# EAGLE design controller_board (EAGLE 7.2.0)
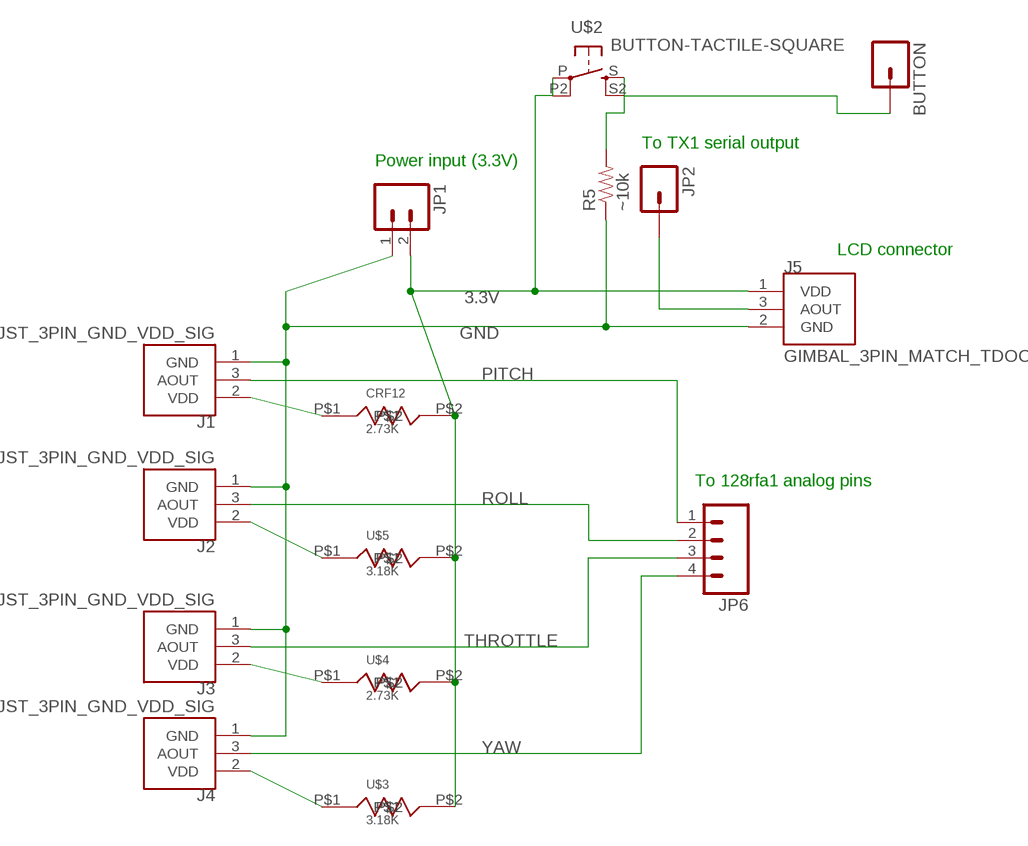
[diagram p0: schematic, sheet 1]

## Parts
BUTTON  M01PTH  [1X01]
CRF12  2.73K  CRF12  [CFR12]
J1  JST_3PIN_GND_VDD_SIG  [JST-3-PTH-REVERSE]
J2  JST_3PIN_GND_VDD_SIG  [JST-3-PTH-REVERSE]
J3  JST_3PIN_GND_VDD_SIG  [JST-3-PTH-REVERSE]
J4  JST_3PIN_GND_VDD_SIG  [JST-3-PTH-REVERSE]
J5  GIMBAL_3PIN_MATCH_TDOCU  [JST-3-PTH]
JP1  M021X02_NO_SILK  [1X02_NO_SILK]
JP2  M01PTH  [1X01]
JP6  M04PTH  [1X04]
R5  ~10k  RESISTORPTH-1/4W  [AXIAL-0.4]
U$2  BUTTON-TACTILE-SQUARE  [BUTTON-TACTILE-SQUARE-ADAFRUIT1010]
U$3  3.18K  CRF12  [CFR12]
U$4  2.73K  CRF12  [CFR12]
U$5  3.18K  CRF12  [CFR12]

## Nets
3.3V: CRF12.P$2 J5.1(VDD) JP1.2 U$2.P U$2.P2(P1) U$3.P$2 U$4.P$2 U$5.P$2
GND: J1.1(GND) J2.1(GND) J3.1(GND) J4.1(GND) J5.2(GND) JP1.1 R5.P$1
N$1: J4.2(VDD) U$3.P$1
N$2: J3.2(VDD) U$4.P$1
N$3: CRF12.P$1 J1.2(VDD)
N$4: J2.2(VDD) U$5.P$1
N$6: BUTTON.1 R5.P$2 U$2.S U$2.S2(S1)
N$9: J5.3(AOUT) JP2.1
PITCH: J1.3(AOUT) JP6.1
ROLL: J2.3(AOUT) JP6.2
THROTTLE: J3.3(AOUT) JP6.3
YAW: J4.3(AOUT) JP6.4

## Notes on the sheet
- To TX1 serial output
- Power input (3.3V)
- LCD connector
- To 128rfa1 analog pins

## Library data of the parts
BUTTON JP2 = SparkFun-Connectors:M01: Header 1 Standard 1-pin 0.1" header. Use with straight break away headers (SKU : PRT-00116), right angle break away headers (PRT-00553), swiss pins (PRT-00743), machine pins (PRT-00117), and female headers (PRT-00115).
CRF12 U$3-U$5 = lab4:CRF12
J1-J4 = Controller:JST_3PIN_GND_VDD_SIG
J5 = Controller:GIMBAL_3PIN_MATCH_TDOCU
JP1 = SparkFun-Connectors:M02: Standard 2-pin 0.1" header. Use with - straight break away headers ( PRT-00116) - right angle break away headers (PRT-00553) - swiss pins (PRT-00743) - machine pins (PRT-00117) - female headers (PRT-00115) Molex polarized connector foot print use with: PRT-08233 with associated crimp pins and housings. 2.54_SCREWTERM for use with PRT-10571. 3.5mm Screw Terminal footprints for PRT-08084 5mm Screw Terminal footprints for use with PRT-08432
JP6 = SparkFun-Connectors:M04: Header 4 Standard 4-pin 0.1" header. Use with straight break away headers (SKU : PRT-00116), right angle break away headers (PRT-00553), swiss pins (PRT-00743), machine pins (PRT-00117), and female headers (PRT-00115). Molex polarized connector foot print use with SKU : PRT-08231 with associated crimp pins and housings. 1MM SMD Version SKU: PRT-10208
R5 = SparkFun-Resistors:RESISTOR: Resistor Basic schematic elements and footprints for 0603, 1206, and PTH resistors.
U$2 = Controller:BUTTON-TACTILE

## Board
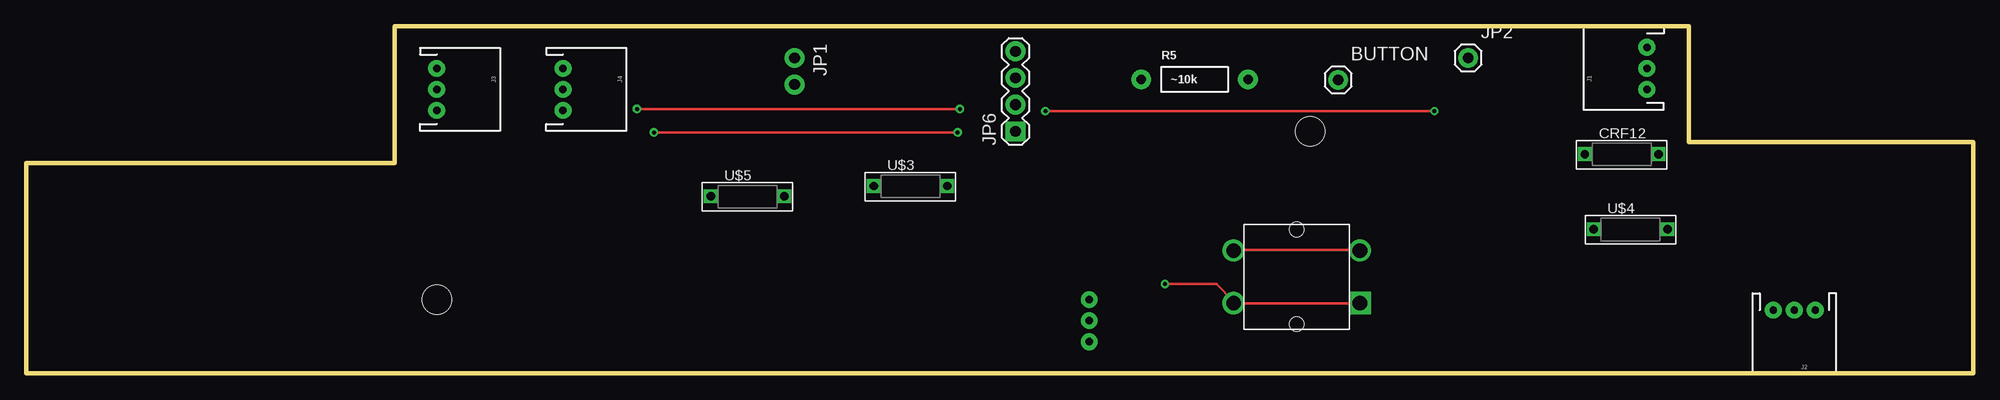
[diagram p1: board, top side]
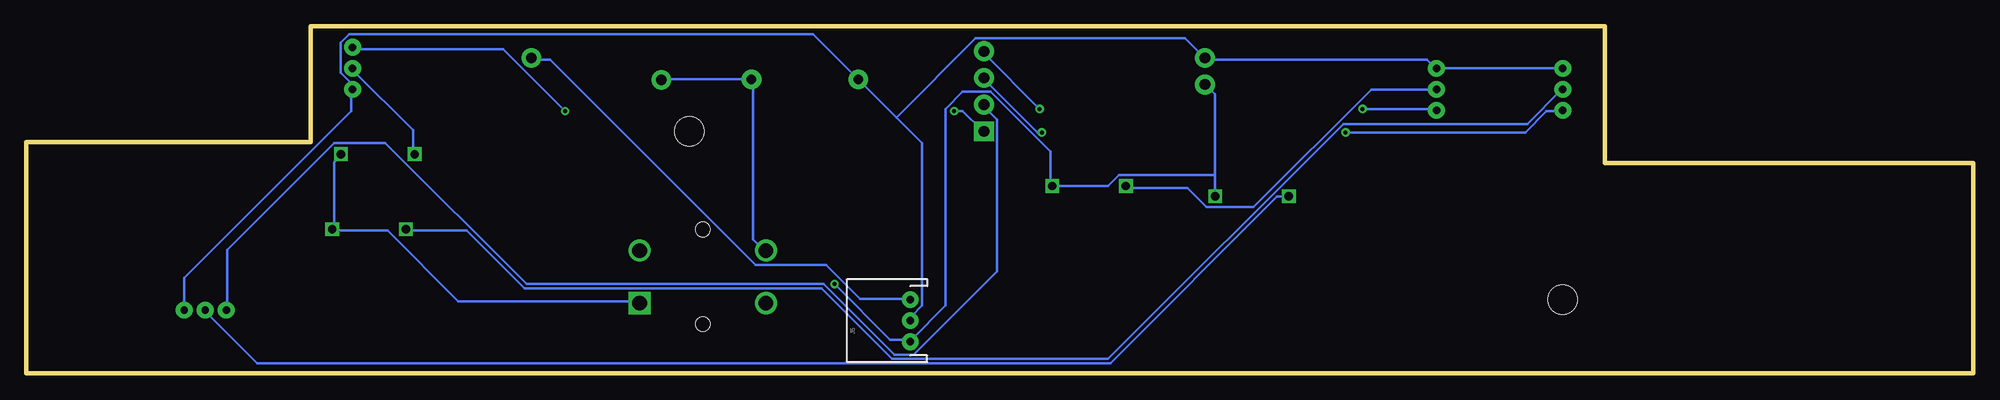
[diagram p2: board, bottom side, seen from below]

Size 185 x 33 mm. Coordinates in mm from the lower left corner, seen from the top.
Outline: 158,22 158,33 35,33 35,20 0,20 0,0 185,0 185,22 158,22
Copper layers (1*16): Top 0.035559375mm / dielectric 1.501140625mm / Bottom 0.035559375mm
Design rules "4pcb-33board": minimum track width 10mil, minimum drill 15mil, track to track 6mil, track to pad 6mil, pad to pad 6mil, via to via 6mil, smd to smd 6mil, copper to edge 10mil, drill to drill 10mil, minimum pad ring 10mil, minimum via ring 8mil, stop-mask expansion 4mil, vias tented up to drill 0mil, thermal gap 10mil
tRestrict: area 36.6,22.5 to 45.5,31.3; area 49.3,22.5 to 56.9,31.3; area 70.9,26.3 to 74.7,31.3; area 63.2,14.8 to 73.4,18.6; area 78.5,16.1 to 88.7,19.9; area 91.2,21.2 to 96.3,32.6; area 103.9,26.3 to 117.9,30.1; area 98.8,0.9 to 107.7,9.8; area 121.7,26.3 to 139.4,31.3; area 147.1,18.6 to 156,22.5; area 147.1,12.3 to 157.2,16.1; area 147.1,25 to 156,32.6; 1 more areas

### Footprints (pad centres in the part's own frame; a part is rotated, then mirrored left to right if it is on the bottom)
1X01 = drill 1.016 pad 1.88: 1 0,0
CFR12 = drill 0.8 square: P$1 -3.5,0; P$2 3.5,0
JST-3-PTH-REVERSE = drill 0.7 pad 1.6: 1 -2,0; 2 0,0; 3 2,0
JST-3-PTH = drill 0.7 pad 1.6: 1 -2,0; 2 0,0; 3 2,0
1X02_NO_SILK = drill 1.016 pad 1.88: 1 0,0; 2 2.54,0
1X04 = drill 1.016 pad 1.88 square: 1 0,0 | drill 1.016 pad 1.88: 2 2.54,0; 3 5.08,0; 4 7.62,0
AXIAL-0.4 = drill 0.9 pad 1.88: P$1 -5.08,0; P$2 5.08,0
CONNECTOR_BOARD_OUTLINE = hole 2.8: 154,45; 71,29
BUTTON-TACTILE-SQUARE-ADAFRUIT1010 = drill 1.4 square: P -6,2.5 | drill 1.4: P2 6,2.5; S -6,-2.5; S2 6,-2.5 | hole 1.4: 0,-4.5; 0,4.5

### Placement (x,y rotation side)
BUTTON  124.66,27.9 0 top
CRF12  151.6,20.83 0 top
J1  154,29 90 top
J2  168,6 180 top
J3  39,27 270 top
J4  51,27 270 top
J5  101,5 90 bottom
JP1  73,30 270 top
JP2  137,30 0 top
JP6  94,23 90 top
R5  111.01,27.94 0 top
U$1  [CONNECTOR_BOARD_OUTLINE]  -32,-22 0 top
U$2  120.72,9.17 180 top
U$3  84.01,17.8 0 top
U$4  152.44,13.7 0 top
U$5  68.53,16.82 0 top

### Tracks (layer width: path | path; a pad name or v marks a point on that pad's centre or on a via)
3.3V  (via drill 0.38)
  Top 0.254: U$2.P 126.7,6.65 114.91,6.65 U$2.P2 114.71,6.85 113.09,8.48 v108.21,8.48
  Bottom 0.254: 72.04,18.84 72.04,26.56 72.85,27.38 JP1.2 | 72.04,18.84 72.04,17.01 U$5.P$2 | 72.04,18.84 81.18,18.84 82.2,17.83 87.48,17.83 U$3.P$2 87.69,17.83 87.69,21.08 93.37,26.77 96.02,26.77 97.64,25.14 97.64,6.45 100.89,3.2 J5.1 101.1,3.2 102.93,3.2 v108.21,8.48 | CRF12.P$2 155.15,20.67 155.76,20.06 155.76,13.76 U$4.P$2 155.76,13.56 150.68,13.56 143.97,6.85 126.9,6.85 U$2.P
GND
  Bottom 0.254: J2.1 169.98,6.04 169.98,9.09 154.13,24.94 154.13,26.97 J1.1 154.13,27.17 154.13,27.58 155.15,28.6 155.15,31.44 154.33,32.25 110.24,32.25 105.97,27.99 R5.P$1 105.77,27.78 102.31,24.33 | 102.31,24.33 99.88,21.89 99.88,6.45 100.89,5.43 100.89,5.03 J5.2 | J3.1 39.12,29 50.91,29 J4.1 51.11,29 51.92,29.82 72.85,29.82 JP1.1 73.05,30.02 74.88,31.85 94.8,31.85 102.31,24.33
N$1
  Bottom 0.254: U$3.P$1 80.37,17.62 74.68,17.62 72.85,15.8 68.38,15.8 57.2,26.97 51.11,26.97 J4.2
N$2
  Bottom 0.254: U$4.P$1 148.85,13.56 143.16,13.56 137.67,8.07 109.43,8.07 102.72,1.37 82.2,1.37 59.85,23.72 42.37,23.72 39.12,26.97 J3.2
N$3
  Bottom 0.254: CRF12.P$1 148.24,20.88 148.24,23.11 153.93,28.8 J1.2
N$4
  Bottom 0.254: U$5.P$1 65.13,16.81 66.15,16.81 82,0.96 163.07,0.96 167.95,5.84 J2.2
N$6
  Top 0.254: U$2.S2 114.91,11.73 126.7,11.73 U$2.S
  Bottom 0.254: BUTTON.1 124.46,27.99 116.13,27.99 R5.P$2 115.93,27.78 115.93,12.75 114.91,11.73 U$2.S2
N$9
  Bottom 0.254: J5.3 101.1,7.06 105.77,7.06 109.02,10.31 115.73,10.31 135.23,29.82 136.86,29.82 JP2.1
PITCH  (via drill 0.38)
  Top 0.254: v96.83,24.94 v133.81,24.94
  Bottom 0.254: v133.81,24.94 139.7,30.83 153.93,30.83 J1.3 | v96.83,24.94 96.02,24.94 94.19,23.11 JP6.1
ROLL
  Bottom 0.254: J2.3 165.92,6.04 165.92,11.73 155.76,21.89 150.88,21.89 137.47,8.48 109.22,8.48 102.52,1.77 100.69,1.77 92.77,9.7 92.77,24.13 93.98,25.35 JP6.2
THROTTLE  (via drill 0.38)
  Top 0.254: v88.5,22.91 v59.64,22.91
  Bottom 0.254: v59.64,22.91 42.57,22.91 40.54,24.94 39.12,24.94 J3.3 | v88.5,22.91 88.9,22.91 93.98,27.99 JP6.3
YAW  (via drill 0.38)
  Top 0.254: v88.7,25.14 v58.02,25.14
  Bottom 0.254: v58.02,25.14 51.11,25.14 J4.3 | v88.7,25.14 93.98,30.43 JP6.4

### Text on the board
tRubout: Matt Asaro